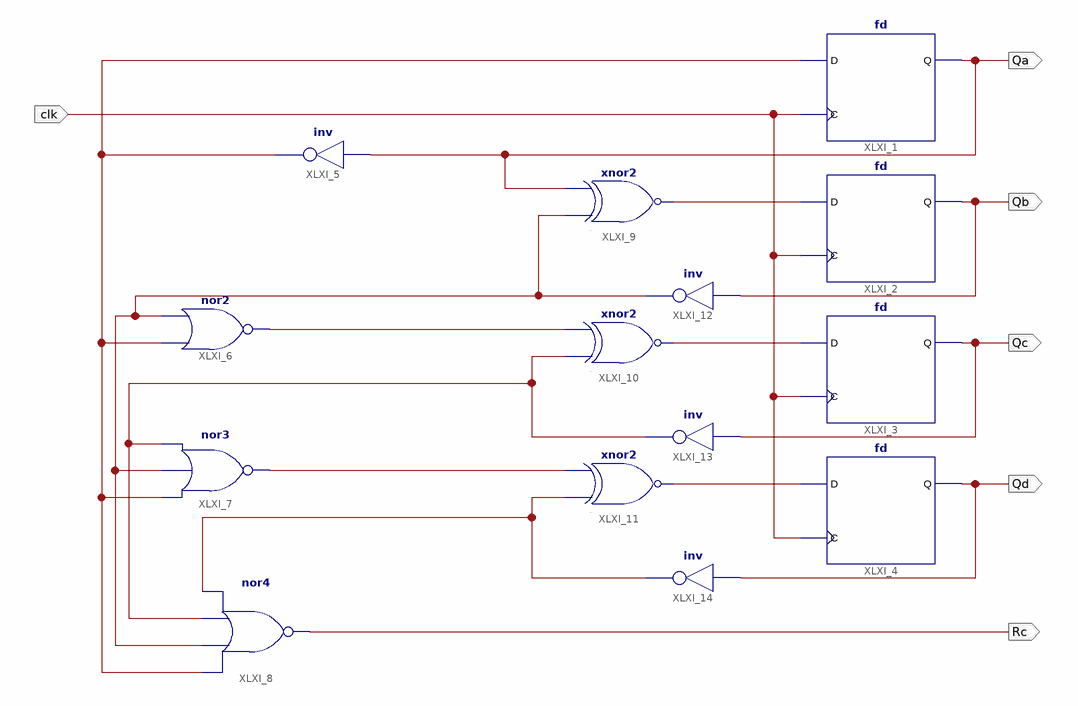
[diagram p0: schematic sheet 1]
// Xilinx ISE schematic Counter_4bit.sch (kintex7) as structural Verilog: 14 symbols, 6 ports
module Counter_4bit (
  input  clk,
  output Qa,
  output Qb,
  output Qc,
  output Qd,
  output Rc
);

  wire XLXN_7, XLXN_8, XLXN_9, XLXN_10, XLXN_14, XLXN_15, XLXN_17, XLXN_21, XLXN_22;

  fd XLXI_1 (.C(clk), .D(XLXN_10), .Q(Qa));
  fd XLXI_2 (.C(clk), .D(XLXN_7), .Q(Qb));
  fd XLXI_3 (.C(clk), .D(XLXN_8), .Q(Qc));
  fd XLXI_4 (.C(clk), .D(XLXN_9), .Q(Qd));
  not XLXI_5 (XLXN_10, Qa);
  nor XLXI_6 (XLXN_15, XLXN_10, XLXN_14);
  nor XLXI_7 (XLXN_21, XLXN_10, XLXN_14, XLXN_17);
  nor XLXI_8 (Rc, XLXN_10, XLXN_14, XLXN_17, XLXN_22);
  xnor XLXI_9 (XLXN_7, XLXN_14, Qa);
  xnor XLXI_10 (XLXN_8, XLXN_17, XLXN_15);
  xnor XLXI_11 (XLXN_9, XLXN_22, XLXN_21);
  not XLXI_12 (XLXN_14, Qb);
  not XLXI_13 (XLXN_17, Qc);
  not XLXI_14 (XLXN_22, Qd);
endmodule
